# Altium schematic sheet sensormodule.SchDoc: VL53L0X Module
size A4; Organization: ED-ROBOTSM; Revision: 1; SheetNumber: 1; SheetTotal: 1
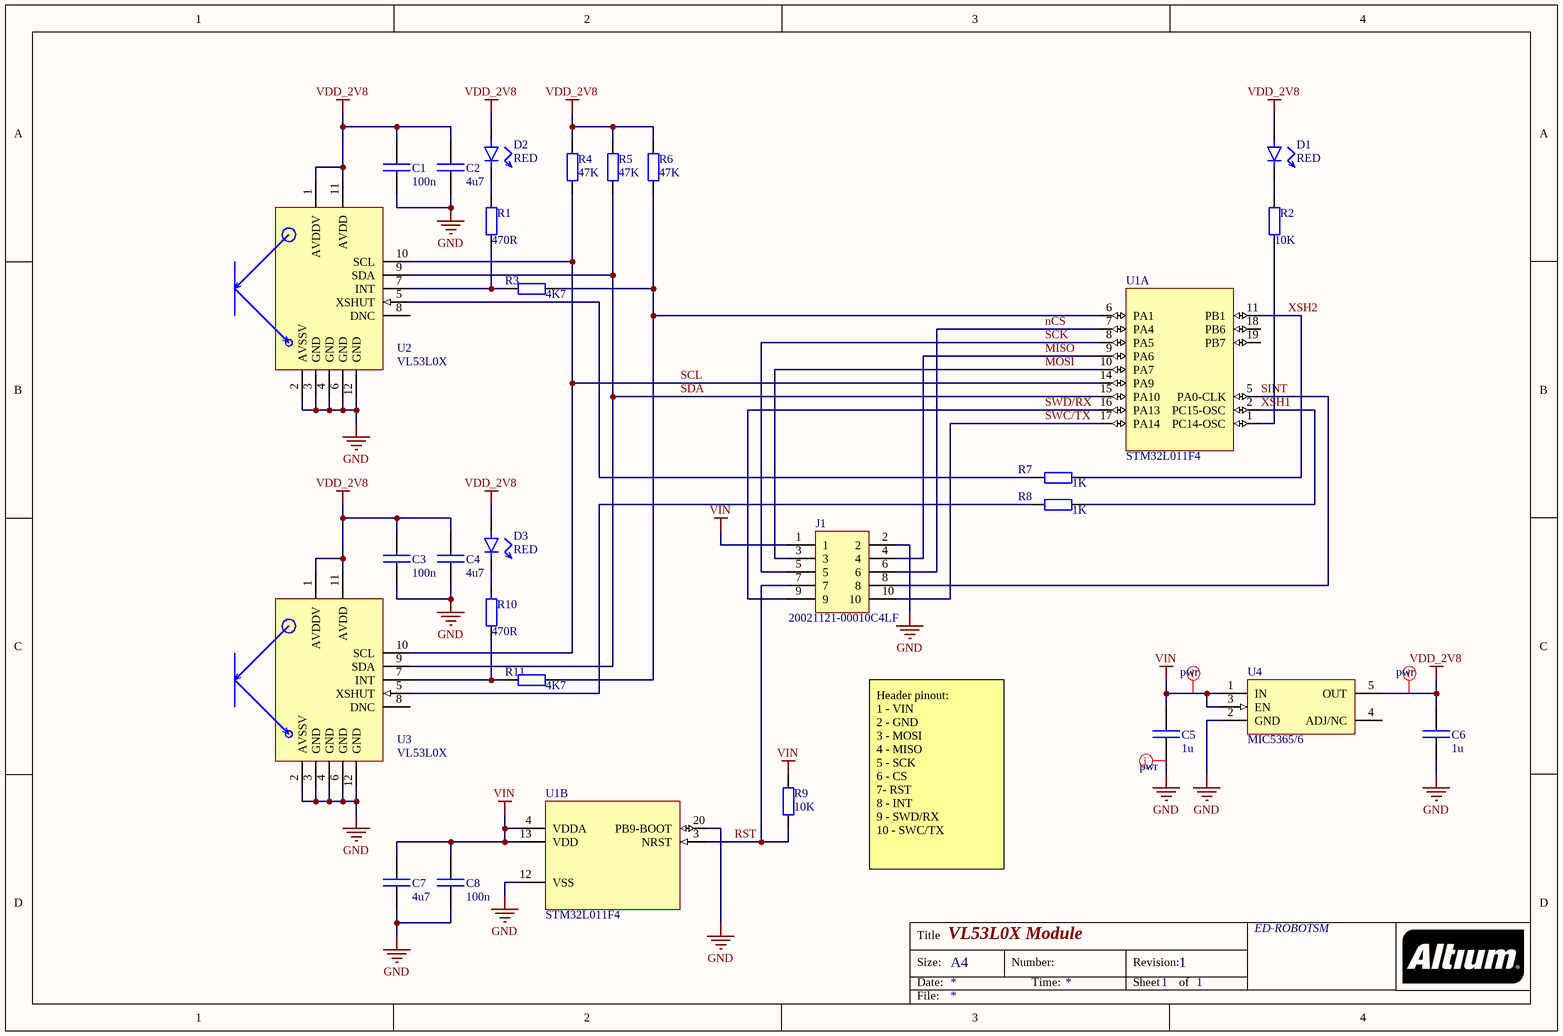
[diagram p0: sensormodule.SchDoc]

## Parts
C1  value 100n  [CAPC1005X06N]  (hidden comment: cap)
C2  value 4u7  [CAPC2012X11N]  (hidden comment: cap)
C3  value 100n  [CAPC1005X06N]  (hidden comment: cap)
C4  value 4u7  [CAPC2012X11N]  (hidden comment: cap)
C5  value 1u  [CAPC1005X06N]  (hidden comment: cap)
C6  value 1u  [CAPC1005X06N]  (hidden comment: cap)
C7  value 4u7  [CAPC2012X11N]  (hidden comment: cap)
C8  value 100n  [CAPC1005X06N]  (hidden comment: cap)
D1  value RED  [CAPCP1005X06N]  (hidden comment: led)
D2  value RED  [CAPCP1005X06N]  (hidden comment: led)
D3  value RED  [CAPCP1005X06N]  (hidden comment: led)
J1  20021121-00010C4LF  [hdr_2x5_50mil]
R1  value 470R  [RESC1005X04N]  (hidden comment: res)
R2  value 10K  [RESC1005X04N]  (hidden comment: res)
R3  value 4K7  [RESC1005X04N]  (hidden comment: res)
R4  value 47K  [RESC1005X04N]  (hidden comment: res)
R5  value 47K  [RESC1005X04N]  (hidden comment: res)
R6  value 47K  [RESC1005X04N]  (hidden comment: res)
R7  value 1K  [RESC1005X04N]  (hidden comment: res)
R8  value 1K  [RESC1005X04N]  (hidden comment: res)
R9  value 10K  [RESC1005X04N]  (hidden comment: res)
R10  value 470R  [RESC1005X04N]  (hidden comment: res)
R11  value 4K7  [RESC1005X04N]  (hidden comment: res)
U1  STM32L011F4  [QFN50P300X300X60-20N]  (parts A,B of 2)
U2  VL53L0X  [LGA12C80P3X5_240X440X105]
U3  VL53L0X  [LGA12C80P3X5_240X440X105]
U4  MIC5365/6  [SOT65P210X110-5N]

## Nets
GND: C1.1 C2.1 C3.1 C4.1 C5.1 C6.1 C7.1 C8.1 J1.2 U1.12(VSS) U1.20(PB9-BOOT) U2.2(AVSSV) U2.3(GND) U2.4(GND) U2.6(GND) U2.12(GND) U3.2(AVSSV) U3.3(GND) U3.4(GND) U3.6(GND) U3.12(GND) U4.2(GND)
VDD_2V8: C1.2 C2.2 C3.2 C4.2 C6.2 D1.A D2.A D3.A R4.2 R5.2 R6.2 U2.1(AVDDV) U2.11(AVDD) U3.1(AVDDV) U3.11(AVDD) U4.5(OUT)
VIN: C5.2 C7.2 C8.2 J1.1 R9.2 U1.4(VDDA) U1.13(VDD) U4.1(IN) U4.3(EN)
MISO: J1.4 U1.9(PA6)
MOSI: J1.3 U1.10(PA7)
nCS: J1.6 U1.7(PA4)
RST: J1.7 R9.1 U1.3(NRST)
SCK: J1.5 U1.8(PA5)
SCL: R4.1 U1.14(PA9) U2.10(SCL) U3.10(SCL)
SDA: R5.1 U1.15(PA10) U2.9(SDA) U3.9(SDA)
SINT: J1.8 U1.5(PA0-CLK)
SWC/TX: J1.10 U1.17(PA14)
SWD/RX: J1.9 U1.16(PA13)
XSH1: R8.1 U1.2(PC15-OSC)
XSH2: R7.1 U1.11(PB1)
NetD1_C: D1.C R2.2
NetD2_C: D2.C R1.2
NetD3_C: D3.C R10.2
NetR1_1: R1.1 R3.2 U2.7(INT)
NetR2_1: R2.1 U1.1(PC14-OSC)
NetR3_1: R3.1 R6.1 R11.1 U1.6(PA1)
NetR7_2: R7.2 U2.5(XSHUT)
NetR8_2: R8.2 U3.5(XSHUT)
NetR10_1: R10.1 R11.2 U3.7(INT)

Not connected (* = marked no-connect by the designer): U1 18(PB6) 19(PB7); U2 8(DNC); U3 8(DNC); U4 4(ADJ/NC)

## Layout directives
net class pwr: GND, VDD_2V8, VIN

## Notes on the sheet
- Header pinout:
  1 - VIN
  2 - GND
  3 - MOSI
  4 - MISO
  5 - SCK
  6 - CS
  7- RST
  8 - INT
  9 - SWD/RX
  10 - SWC/TX
- Title
- Size:
- Date:
- A4
- Number:
- Time:
- Revision:
- Sheet
- of
- File:

## Library data of the parts
C1-C8 = cap: Capacitor
D1-D3 = led: pin to pad: A>1 C>2
J1 = hdr_2x5: 2x5 Header
R1-R11 = res: Resistor
U1 = stm32l011f4u
U2 U3 = vl53l0x: vl53l0x ToF sensor
U4 = mic5365: 5pin voltage regulator